# EAGLE design control_board (EAGLE 9.2.2)
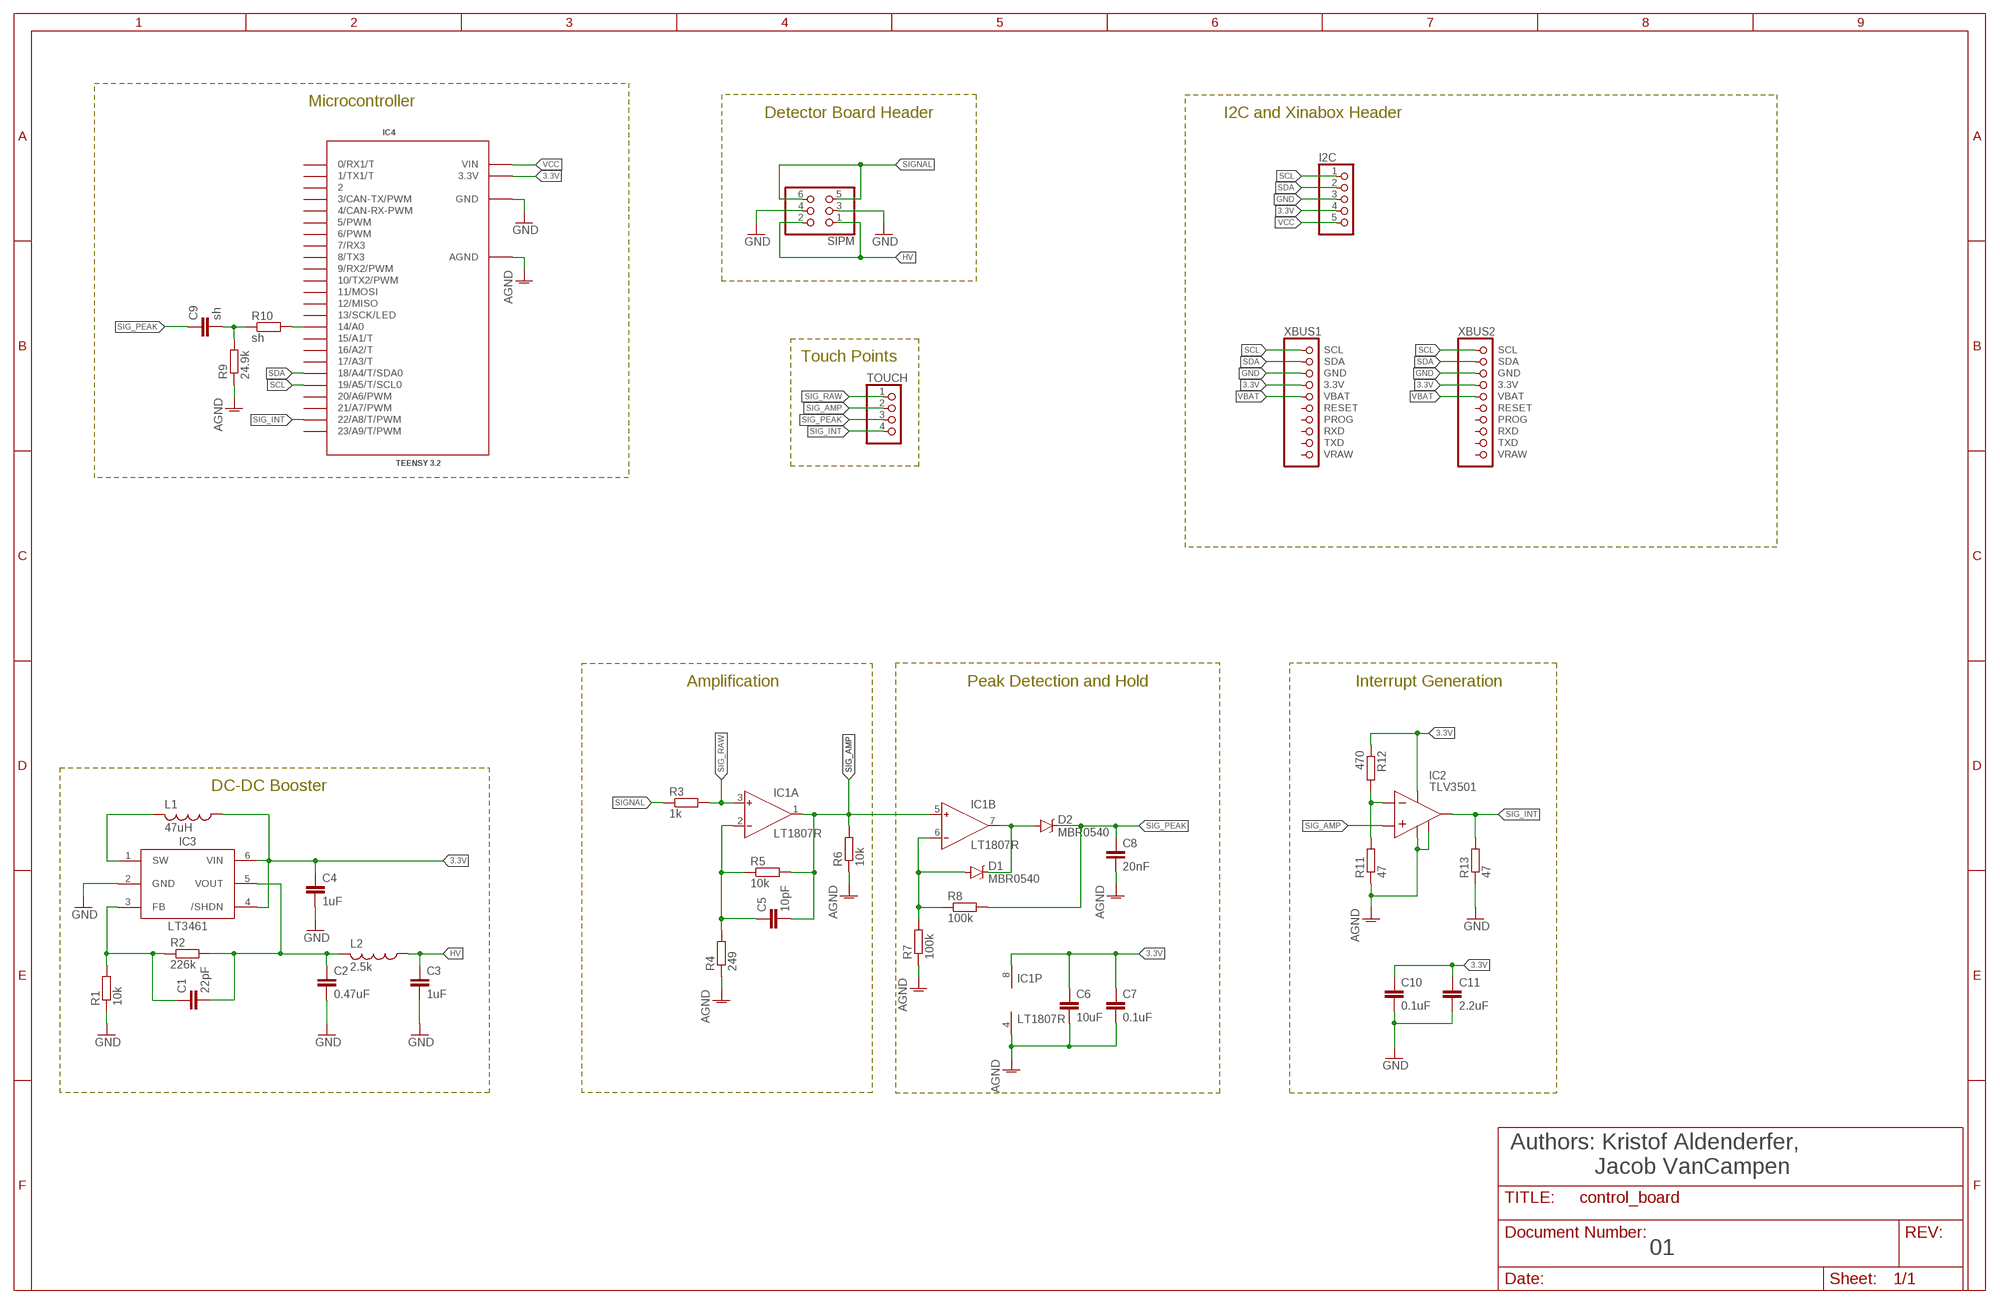
[diagram p0: schematic, sheet 1]

## Parts
C1  22pF  C-EUC0805K  [C0805K]
C2  0.47uF  C-EUC0805K  [C0805K]
C3  1uF  C-EUC0805K  [C0805K]
C4  1uF  C-EUC0805K  [C0805K]
C5  10pF  C-EUC0805K  [C0805K]
C6  10uF  C-EUC0805K  [C0805K]
C7  0.1uF  C-EUC0805K  [C0805K]
C8  20nF  C-EUC0805K  [C0805K]
C9  sh  C-EUC0805K  [C0805K]
C10  0.1uF  C-EUC0805  [C0805]
C11  2.2uF  C-EUC0805  [C0805]
D1  MBR0540  DIODE-SCHOTTKY-B340A  [SMA-DIODE]
D2  MBR0540  DIODE-SCHOTTKY-B340A  [SMA-DIODE]
I2C  PINHD-1X5  [1X05]
IC1  LT1807R  [SO8]
IC2  TLV3501  [SOT23-6]
IC3  LT3461  [SOT23-6]
IC4  TEENSY 3.2  TEENSY_3.2_NO_BOTTOM  [TEENSY_3.2_NO_BOTTOM]
L1  47uH  L-USL3225M  [L3225M]
L2  2.5k  L-USL2012C  [L2012C]
R1  10k  R-EU_M0805  [M0805]
R2  226k  R-EU_M0805  [M0805]
R3  1k  R-EU_M0805  [M0805]
R4  249  R-EU_M0805  [M0805]
R5  10k  R-EU_M0805  [M0805]
R6  10k  R-EU_M0805  [M0805]
R7  100k  R-EU_M0805  [M0805]
R8  100k  R-EU_M0805  [M0805]
R9  24.9k  R-EU_M0805  [M0805]
R10  sh  R-EU_M0805  [M0805]
R11  47  R-EU_M0805  [M0805]
R12  470  R-EU_M0805  [M0805]
R13  47  R-EU_M0805  [M0805]
SIPM  PINHD-2X3  [2X03]
TOUCH  PINHD-1X4  [1X04]
XBUS1  XINABOX-XBUS  [XBUS_2X05_PAD]
XBUS2  XINABOX-XBUS  [XBUS_2X05_PAD]

## Nets
3.3V: C4.1 C6.1 C7.1 C10.1 C11.1 I2C.4 IC1.8(P:V+) IC2.P$4(V+) IC3.4(/SHDN) IC3.6(VIN) IC4.3.3V L1.1 R12.1 XBUS1.VCC(3.3V) XBUS2.VCC(3.3V)
AGND: C6.2 C7.2 C8.2 IC1.4(P:V-) IC2.P$2(V-) IC2.P$6(SHDN) IC4.AGND R4.1 R6.1 R7.1 R9.1 R11.1
GND: C2.2 C3.2 C4.2 C10.2 C11.2 I2C.3 IC3.2(GND) IC4.GND R1.1 R13.1 SIPM.3 SIPM.4 XBUS1.GND XBUS2.GND
HV: C3.1 L2.1 SIPM.1 SIPM.2
N$1: IC3.1(SW) L1.2
N$2: D1.C D2.A IC1.7(B:OUT)
N$3: C1.1 IC3.3(FB) R1.2 R2.1
N$4: D1.A IC1.6(B:IN-) R7.2 R8.1
N$5: IC2.P$1(IN-) R11.2 R12.2
N$7: C1.2 C2.1 IC3.5(VOUT) L2.2 R2.2
N$8: C5.1 IC1.2(A:IN-) R4.2 R5.1
N$9: C9.2 R9.2 R10.1
N$10: IC4.14/A0 R10.2
SCL: I2C.1 IC4.19/A5(19/A5/T/SCL0) XBUS1.SCL XBUS2.SCL
SDA: I2C.2 IC4.18/A4(18/A4/T/SDA0) XBUS1.SDA XBUS2.SDA
SIG_AMP: C5.2 IC1.1(A:OUT) IC1.5(B:IN+) IC2.P$3(IN+) R5.2 R6.2 TOUCH.2
SIG_INT: IC2.P$5(OUT) IC4.22/A8(22/A8/T/PWM) R13.2 TOUCH.4
SIG_PEAK: C8.1 C9.1 D2.C R8.2 TOUCH.3
SIG_RAW: IC1.3(A:IN+) R3.2 TOUCH.1
SIGNAL: R3.1 SIPM.5 SIPM.6
VBAT: XBUS1.VBAT XBUS2.VBAT
VCC: I2C.5 IC4.VIN
Unconnected: IC4.0(0/RX1/T) IC4.1(1/TX1/T) IC4.2 IC4.3(3/CAN-TX/PWM) IC4.4(4/CAN-RX-PWM) IC4.5(5/PWM) IC4.6(6/PWM) IC4.7(7/RX3) IC4.8(8/TX3) IC4.9(9/RX2/PWM) IC4.10(10/TX2/PWM) IC4.11(11/MOSI) IC4.12(12/MISO) IC4.13(13/SCK/LED) IC4.15/A1(15/A1/T) IC4.16/A2(16/A2/T) IC4.17/A3(17/A3/T) IC4.20/A6(20/A6/PWM) IC4.21/A7(21/A7/PWM) IC4.23/A9(23/A9/T/PWM) XBUS1.PROG XBUS1.RESET XBUS1.RXD XBUS1.TXD XBUS1.VRAW XBUS2.PROG XBUS2.RESET XBUS2.RXD XBUS2.TXD XBUS2.VRAW

## Notes on the sheet
- Microcontroller
- Detector Board Header | I2C and Xinabox Header
- Touch Points
- Amplification | Peak Detection and Hold | Interrupt Generation
- DC-DC Booster
- Authors: Kristof Aldenderfer,
               Jacob VanCampen
- 01

## Library data of the parts
C1-C11 = rcl:C-EU: CAPACITOR, European symbol; SPICEPREFIX: C
D1 D2 = SparkFun-DiscreteSemi:DIODE-SCHOTTKY: Schottky diodes in SFE's production catalog BAT20J 1A 23V 0.62Vf RB751 120mA 40V 0.37Vf PMEG4005EJ 0.5A 40V 0.42Vf MBRA140 1A 40V 0.5Vf B340A 3A 40V SMA; PROD_ID: DIO-09886; VALUE: B340A
I2C = pinhead:PINHD-1X5: PIN HEADER
IC1 = personal:LT1807: Dual Precision, 500 ns Settling, BiFET Op Amp Source: http://www.analog.com/static/imported-files/data_sheets/AD746.pdf; MF: ALTERA CORPORATION; MPN: AD746JRZ; OC_FARNELL: 1423876; OC_NEWARK: 59K4845
IC2 = AU_Thinsat_Comparators:TLV3501
IC3 = personal:LT3461: LT3426 1.2MHz, 2A boost converter in SOT-23 http://www.linear.com/pc/productDetail.jsp?navId=H0,C1,C1003,C1042,C1031,C1061,P8430 (Linear website)
IC4 = personal:TEENSY_3.2_NO_BOTTOM: Footprint for Teensy 3.1 board using all pin connections on the outer perimeter
L1 L2 = rcl:L-US: INDUCTOR, American symbol; SPICEPREFIX: L
R1-R10 = rcl:R-EU_: RESISTOR, European symbol; SPICEPREFIX: R
R11-R13 = resistor:R-EU_: RESISTOR, European symbol
SIPM = pinhead:PINHD-2X3: PIN HEADER
TOUCH = pinhead:PINHD-1X4: PIN HEADER
XBUS1 XBUS2 = personal:XINABOX-XBUS: PIN HEADER

## Board
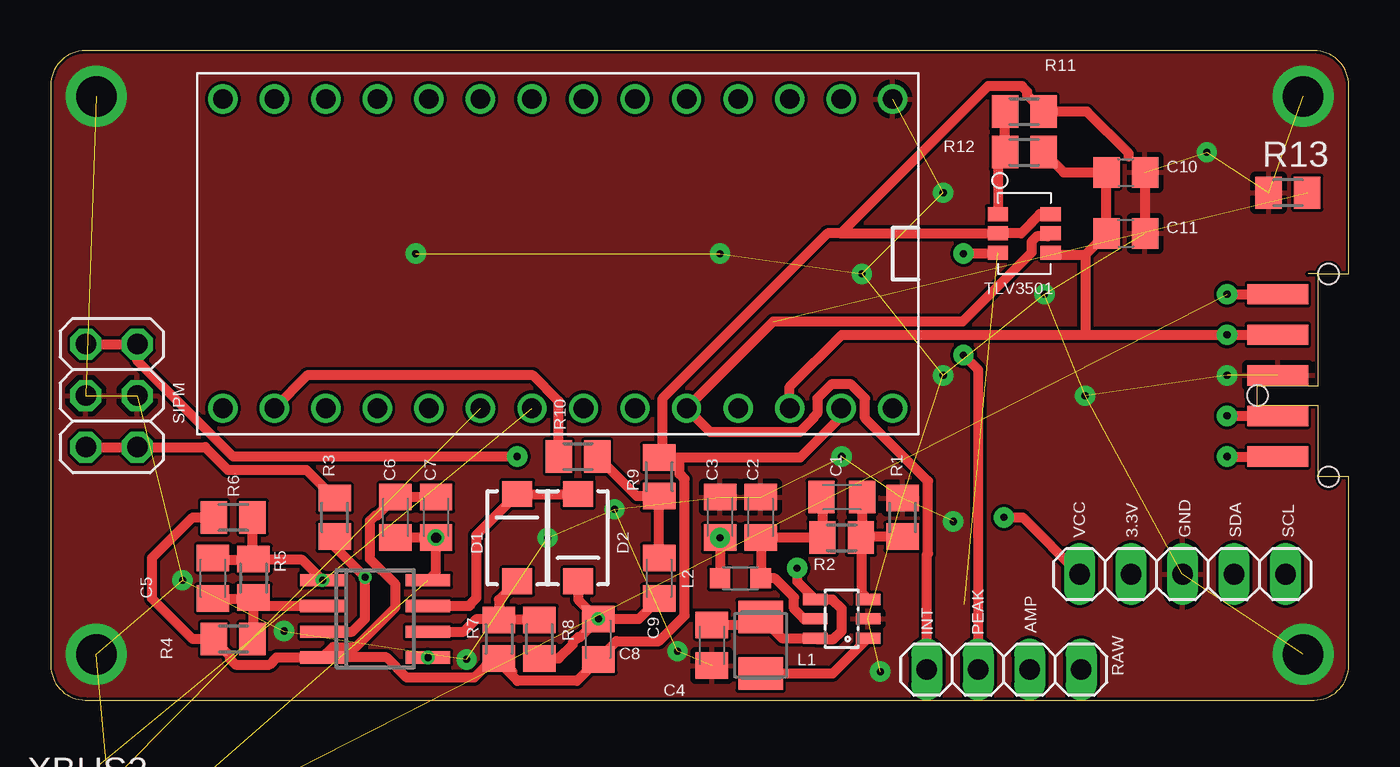
[diagram p1: board, top side]
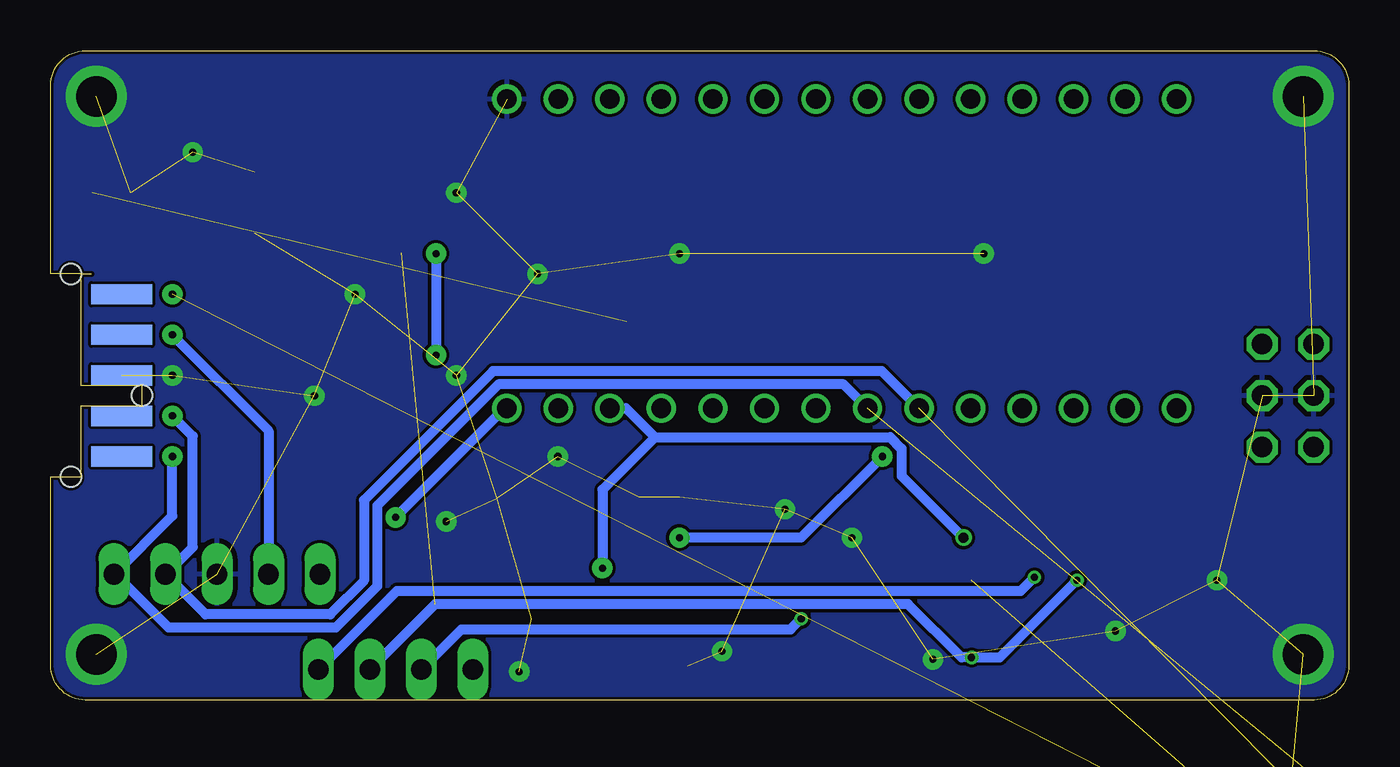
[diagram p2: board, bottom side, seen from below]

Size 64 x 32 mm. Coordinates in mm from the lower left corner, seen from the top.
Outline: 62.5,21 62.5,15.5 59.5,15.5 59.5,14.5 62.5,14.5 62.5,11 64,11 64,1.71 arc-90 62.29,0 1.71,0 arc-90 0,1.71 0,30.29 arc-90 1.71,32 62.29,32 arc-90 64,30.29 64,21 62.5,21
Outline: 62.5,21 62,21
Copper layers (1*16): Top 0.035mm / dielectric 1.5mm / Bottom 0.035mm
Design rules "SparkFun-2-layer-PCBWay-LIMIT": minimum track width 6mil, minimum drill 0.3mm, track to track 6mil, track to pad 6mil, pad to pad 6mil, via to via 6mil, smd to smd 6mil, copper to edge 6mil, drill to drill 6mil, minimum pad ring 6mil, minimum via ring 6mil, stop-mask expansion 4mil, vias tented up to drill 25mil, thermal gap 10mil
Holes 1 mm at 63,11 63,21 59.5,15

### Footprints (pad centres in the part's own frame; a part is rotated, then mirrored left to right if it is on the bottom)
C0805K = smd 1.3 x 1.6: 1 -1,0; 2 1,0
C0805 = smd 1.3 x 1.5: 1 -0.95,0; 2 0.95,0
SMA-DIODE = smd 1.27 x 1.47: A -2.15,0; C 2.15,0
1X05 = drill 1.016 long: 1 -5.08,0; 2 -2.54,0; 3 0,0; 4 2.54,0; 5 5.08,0
SO8 = smd 0.6 x 2.2: 1 -1.905,-2.6; 2 -0.635,-2.6; 3 0.635,-2.6; 4 1.905,-2.6; 5 1.905,2.6; 6 0.635,2.6; 7 -0.635,2.6; 8 -1.905,2.6
SOT23-6 = smd 0.69 x 0.99: P$1 0.95,1.3; P$2 0,1.3; P$3 -0.95,1.3; P$4 -0.95,-1.3; P$5 0,-1.3; P$6 0.95,-1.3
SOT23-6' = smd 0.55 x 1.2: 1 -0.95,-1.3; 2 0,-1.3; 3 0.95,-1.3; 4 0.95,1.3; 5 0,1.3; 6 -0.95,1.3
TEENSY_3.2_NO_BOTTOM = drill 0.965: 0 -7.62,13.97; 1 -7.62,11.43; 2 -7.62,8.89; 3 -7.62,6.35; 3.3V 7.62,11.43; 4 -7.62,3.81; 5 -7.62,1.27; 6 -7.62,-1.27; 7 -7.62,-3.81; 8 -7.62,-6.35; 9 -7.62,-8.89; 10 -7.62,-11.43; 11 -7.62,-13.97; 12 -7.62,-16.51; 13 7.62,-16.51; 14/A0 7.62,-13.97; 15/A1 7.62,-11.43; 16/A2 7.62,-8.89; 17/A3 7.62,-6.35; 18/A4 7.62,-3.81; 19/A5 7.62,-1.27; 20/A6 7.62,1.27; 21/A7 7.62,3.81; 22/A8 7.62,6.35; 23/A9 7.62,8.89; AGND 7.62,13.97; GND -7.62,16.51; VIN 7.62,16.51
L3225M = smd 1.6 x 2.2: 1 -1.4,0; 2 1.4,0
L2012C = smd 1 x 1: 1 -1,0; 2 1,0
M0805 = smd 1.3 x 1.6: 1 -0.95,0; 2 0.95,0
2X03 = drill 1.016 octagon: 1 -2.54,-1.27; 2 -2.54,1.27; 3 0,-1.27; 4 0,1.27; 5 2.54,-1.27; 6 2.54,1.27
1X04 = drill 1.016 long: 1 -3.81,0; 2 -1.27,0; 3 1.27,0; 4 3.81,0
XBUS_2X05_PAD = smd 1 x 3: GND 0,0; SCL -4,0; SDA -2,0; VBAT 4,0; VCC 2,0 | smd 1 x 3 bottom: PROG 2,0; RESET 4,0; RXD 0,0; TXD -2,0; VRAW -4,0

### Placement (x,y rotation side)
C1  39,10 180 top
C2  35,9 90 top
C3  33,9 90 top
C4  32.6,2.7 270 top
C5  8,6 90 top
C6  17,9 90 top
C7  19,9 90 top
C8  27,3 270 top
C9  30,6 90 top
C10  53,26 0 top
C11  53,23 0 top
D1  23,8 90 top
D2  26,8 270 top
I2C  55.8,6.2 180 top
IC1  16,4 270 top
IC2  48,23 90 top
IC3  LT3461  [SOT23-6']  39,4 90 top
IC4  25,22 270 top
L1  35,2.7 270 top
L2  34,6 0 top
R1  42,9 270 top
R2  39,8 180 top
R3  14,9 270 top
R4  9,3 0 top
R5  10,6 90 top
R6  9,9 0 top
R7  22.1,3 90 top
R8  24.1,3 270 top
R9  30,11 270 top
R10  26,12 180 top
R11  48,29 180 top
R12  48,27 180 top
R13  61,25 0 top
SIPM  3,15 270 top
TOUCH  47,1.5 180 top
XBUS1  60.5,16 90 top
XBUS2  3,-6 0 top  (outside the outline)

### Tracks (layer width: path | path; a pad name or v marks a point on that pad's centre or on a via)
3.3V  (via drill 0.35 pad 1, 0.51)  (1 unrouted)
  Top 0.5: 51,18 v58,18 XBUS1.VCC | IC1.8 19,6.3 C7.1 C6.1 | R12.1 49.95,26 C10.1 C11.1 51,21.95 | IC4.3.3V 36.43,15.43 39,18 51,18 | 51,21.95 51,18 | C4.1 34.6,3.7 L1.1 36.05,3.05 IC3.6 37.75,3 38.6,3 39,3.4 39,4.5 38.55,4.95 IC3.4 36.8,5.85 v36.8,6.5 | 51,21.95 49.4,21.95 IC2.P$4
  Bottom 0.5: IC4.3.3V 35.64,14.38 34.22,12.95 | C7.1 22.05,11.05 22.05,12.39 22.6,12.95 34.22,12.95 | v58,18 53.26,13.26 I2C.4 | 34.22,12.95 36.8,10.37 v36.8,6.5
  other vias: 19,8
AGND
  Top 0.5: 31,11.95 R9.1 30.17,12.12 30.17,14.87 38.31,23 38.96,23 | R4.1 8,3 | 8,3 7,3 5,5 5,7 7,9 R6.1 | 22.75,1.21 23.01,0.95 25.95,0.95 C8.2 27.9,2.9 29.99,2.9 31.25,4.16 31.25,10.89 31,11.14 31,11.95 | 22.75,1.21 22.75,1.4 R7.1 | IC1.4 13.92,2.61 15.03,2.61 17,4.58 17,5.7 15.75,6.95 15.75,8.84 16.01,9.1 16.1,9.1 C6.2 C7.2 | 22.75,1.21 21.86,2.1 21.4,1.63 20.87,1.1 17.56,1.1 16.56,2.1 IC1.4 | 8,3 8.85,2.15 8.85,2.01 9.11,1.75 10.79,1.75 11.14,2.1 IC1.4 | 53.15,26.8 53.15,26.94 51.09,29 R11.1 48.15,29.8 48.15,29.99 47.89,30.25 46.21,30.25 38.96,23 | IC4.AGND 38.97,13.97 36.95,11.95 31,11.95 | 38.96,23 IC2.P$2 47.85,23 48.35,23.5 48.35,23.53 48.77,23.95 IC2.P$6
GND  (via drill 0.35 pad 1, 2 pad 3)  (34 unrouted)
  Top 0.5: C10.2 C11.2
  other vias: 20.5,2 58,16 2.25,29.75 61.75,2.25 2.25,2.25 61.75,29.75 24.5,8 27.8,9.4 30.9,2.4 11.5,3.4 6.5,5.9 18,22 33,22 57,27 51,15 40,21 49,20 44,25 44.5,8.8 39,12 44,16 40.9,1.4
  pour Bottom: -1,-1 65,-1 65,33 -1,33
  pour Top: -2,-2 66,-2 66,34 -2,34
HV  (via drill 0.35 pad 1)
  Top 0.5: C3.1 L2.1 | v23,12 9,12 4.27,16.73 SIPM.2 SIPM.1
  Bottom 0.5: v23,12 27,8 C3.1
  other vias: 33,8
N$1
  Top 0.5: L1.2 38.55,1.3 IC3.1
N$2
  Top 0.5: IC1.7 20.63,4.63 20.75,4.75 20.75,4.79 20.98,5.02 20.98,8.13 D1.C D2.A
N$3
  Top 0.5: R1.2 40,8.05 | 40,8.05 R2.1 | IC3.3 40,5.25 40,8.05 | C1.1 40,8.05
N$4
  Top 0.5: IC1.6 20.37,3.37 21,4 22.05,4 R7.2 | R8.1 R7.2 | D1.A 22.1,4.95 R7.2
N$5
  Top 0.5: R11.2 R12.2 46.7,26.65 IC2.P$1
N$7
  Top 0.5: 35.05,8 R2.2 38.05,9.95 C1.2 | 35.05,8 C2.1 | 35.05,8 35.05,6.05 L2.2 35.7,6 36.65,5.05 36.65,4.49 37.13,4 IC3.5
N$8
  Top 0.5: R4.2 10,3.05 10,5 | 10,5 R5.1 10.41,4.63 IC1.2 | C5.1 8.05,5 10,5
N$9
  Top 0.5: C9.2 R9.2 28.9,10.05 R10.1
N$10
  Top 0.5: IC4.14/A0 12.65,16 23.77,16 25.05,14.72 R10.2
SCL  (via drill 0.35 pad 1)  (1 unrouted)
  Top 0.5: v58,12 XBUS1.SCL
  Bottom 0.5: IC4.19/A5 24.91,15.56 41.93,15.56 47.9,9.58 47.9,5.61 49.95,3.57 58.19,3.57 60.82,6.2 I2C.1 58,9.08 v58,12
SDA  (via drill 0.35 pad 1)  (1 unrouted)
  Top 0.5: v58,14 XBUS1.SDA
  Bottom 0.5: IC4.18/A4 23.02,16.21 42.2,16.21 48.56,9.85 48.56,5.88 50.22,4.22 56.36,4.22 I2C.2 57,7.54 57,13 v58,14
SIG_AMP  (via drill 0.35)  (1 unrouted)
  Top 0.5: R6.2 9.95,7 R5.2 10.05,6.91 | 10.05,6.91 12.4,6.91 IC1.1 | C5.2 8.09,6.91 10.05,6.91
  Bottom 0.5: IC1.1 17.21,2.1 v18.6,2.1 19.09,2.1 21.73,4.73 45.04,4.73 TOUCH.2
  other vias: 13.4,5.91
SIG_INT  (1 unrouted)
  Top 0.5: TOUCH.4 43.19,7.15 43.25,7.21 43.25,10.79 40.15,13.89 40.15,14.87 39.46,15.56 38.48,15.56 37.79,14.87 37.79,14.13 37.61,13.94 37.61,13.89 36.92,13.2 32.53,13.2 IC4.22/A8 35.62,18.65 44.95,18.65 48.35,22.05 48.35,22.58 48.62,22.85 49.15,22.85 IC2.P$5
SIG_PEAK  (via drill 0.35, 0.35 pad 1)
  Top 0.5: D2.C 26,4.95 26.95,4 C8.1 | R8.2 25.05,2.05 25.75,2.75 25.75,2.84 26.01,3.1 26.1,3.1 C8.1 | TOUCH.3 45.73,16.27 v45,17 | 46.65,22 v45,22 | C9.1 29,4 C8.1
  Bottom 0.5: TOUCH.3 43.75,3.48 27.52,3.48 C8.1 | v45,22 v45,17
  other vias: 27,4
SIG_RAW  (via drill 0.35)
  Top 0.5: IC1.3 14.87,3.37 15.5,4 v15.5,6.05 14,7.55 R3.2
  Bottom 0.5: TOUCH.1 46.93,5.38 16.17,5.38 v15.5,6.05
SIGNAL
  Top 0.5: SIPM.5 SIPM.6 7.62,12.46 8.73,11.35 12.6,11.35 R3.1
VBAT  (via drill 0.35 pad 1)  (1 unrouted)
  Top 0.5: v58,20 XBUS1.VBAT
VCC  (via drill 0.35 pad 1)
  Top 0.5: v47,9 47.92,9 I2C.5
  Bottom 0.5: IC4.VIN 41.62,14.38 v47,9

### Text on the board
tNames: VCC | 3.3V | GND | SDA | SCL | INT | PEAK | AMP | RAW